# Altium schematic sheet Peripherals.SchDoc: LCL_GDI (DELUX)
size A4; Address1: ludzinc.blogspot.com.au; Address3: www.lowcostlabs.com.au; DocumentNumber: LCL_004; Revision: V2.00; SheetNumber: 6; SheetTotal: 8
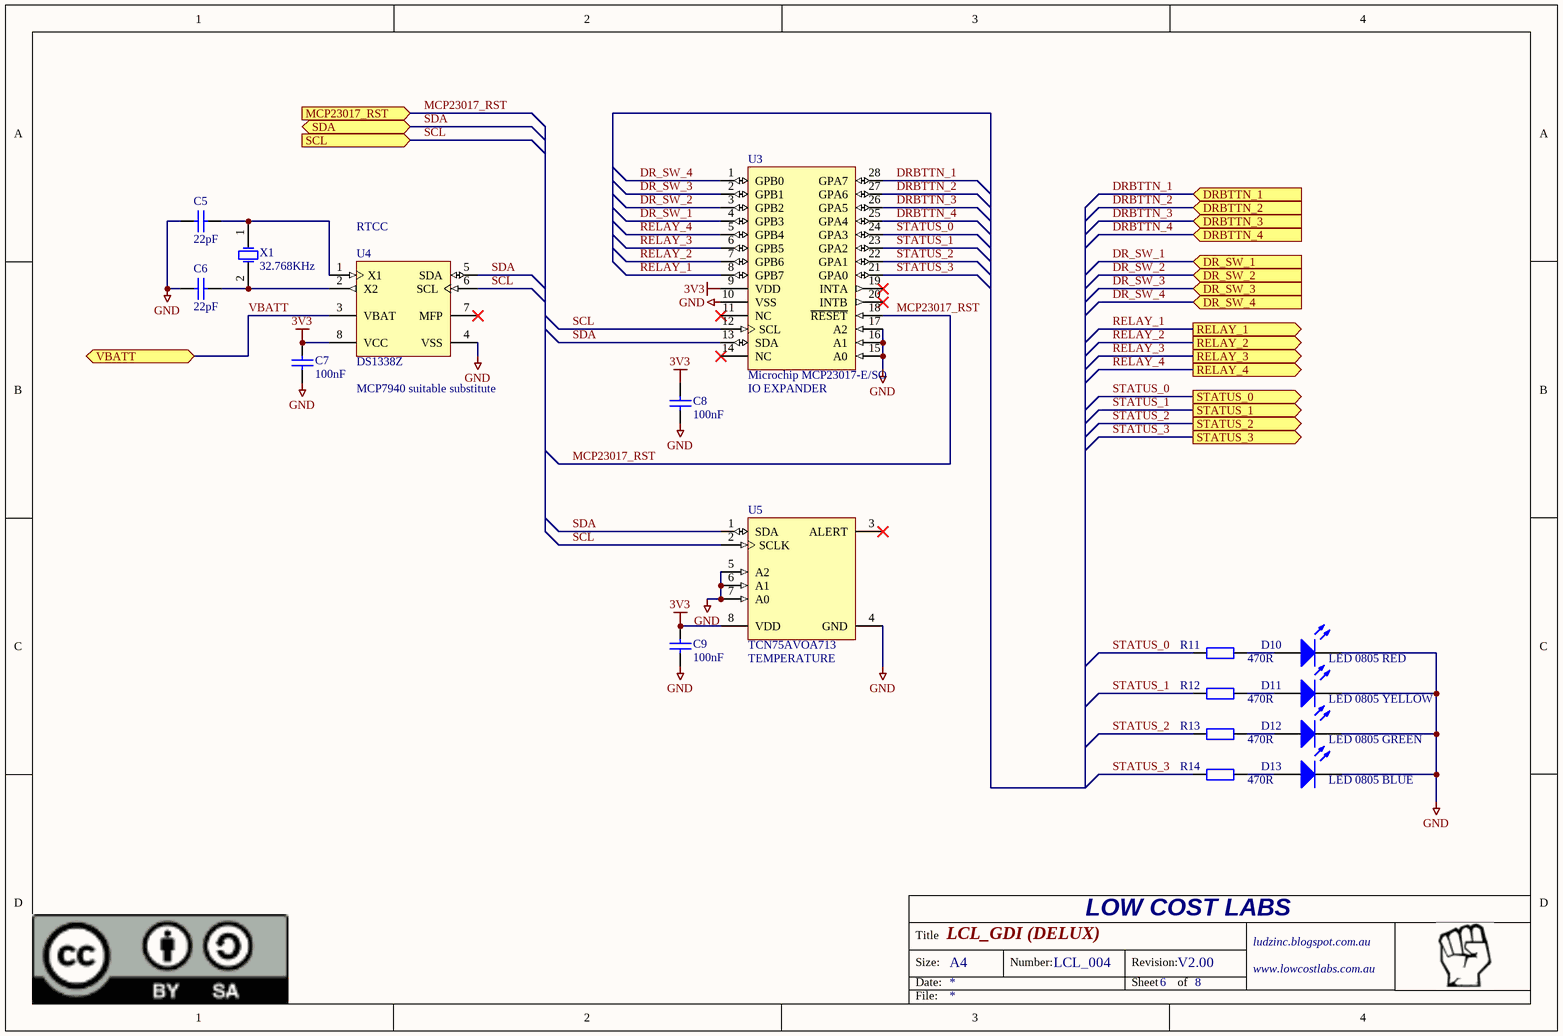
[diagram p0: Peripherals.SchDoc]

## Parts
C5  22pF  [PCB-vlqtv48lgr288fxw4eza-1]
C6  22pF  [PCB-vlqtv48lgr288fxw4eza-1]
C7  100nF  [PCB-vlqtv48lgr288fxw4eza-1]
C8  100nF  [PCB-vlqtv48lgr288fxw4eza-1]
C9  100nF  [PCB-vlqtv48lgr288fxw4eza-1]
D10  LED 0805 RED  [PCB-1071566-1]
D11  LED 0805 YELLOW  [PCB-jd3vqu3yujcdtm6p0xhq-1]
D12  LED 0805 GREEN  [PCB-1071566-1]
D13  LED 0805 BLUE  [PCB-kse1vp9j500ix6ujga0m-1]
R11  470R  [PCB-3652081-2]
R12  470R  [PCB-3652081-2]
R13  470R  [PCB-3652081-2]
R14  470R  [PCB-3652081-2]
U3  Microchip MCP23017-E/SO  [SOIC-SO28_N]
U4  DS1338Z  [SOIC-SN8_N]
U5  TCN75AVOA713  [SOIC-OA8_N]
X1  32.768KHz  [ABRA-AB15T-2_V]

## Ports
DR_SW_1 (in), DR_SW_2 (in), DR_SW_3 (in), DR_SW_4 (in), DRBTTN_1 (in), DRBTTN_2 (in), DRBTTN_3 (in), DRBTTN_4 (in), MCP23017_RST (in), RELAY_1 (out), RELAY_2 (out), RELAY_3 (out), RELAY_4 (out), SCL (in), SDA (bidir), STATUS_0 (out), STATUS_1 (out), STATUS_2 (out), STATUS_3 (out), VBATT

## Nets
3V3: C7.2 C8.2 C9.2 U3.9(VDD) U4.8(VCC) U5.8(VDD)
GND: C5.1 C6.1 C7.1 C8.1 C9.1 D10.K D11.K D12.K D13.K U3.10(VSS) U3.15(A0) U3.16(A1) U3.17(A2) U4.4(VSS) U5.4(GND) U5.5(A2) U5.6(A1) U5.7(A0)
DR_SW_1: U3.4(GPB3) ; port DR_SW_1
DR_SW_2: U3.3(GPB2) ; port DR_SW_2
DR_SW_3: U3.2(GPB1) ; port DR_SW_3
DR_SW_4: U3.1(GPB0) ; port DR_SW_4
DRBTTN_1: U3.28(GPA7) ; port DRBTTN_1
DRBTTN_2: U3.27(GPA6) ; port DRBTTN_2
DRBTTN_3: U3.26(GPA5) ; port DRBTTN_3
DRBTTN_4: U3.25(GPA4) ; port DRBTTN_4
MCP23017_RST: U3.18(~{RESET}) ; port MCP23017_RST
RELAY_1: U3.8(GPB7) ; port RELAY_1
RELAY_2: U3.7(GPB6) ; port RELAY_2
RELAY_3: U3.6(GPB5) ; port RELAY_3
RELAY_4: U3.5(GPB4) ; port RELAY_4
SCL: U3.12(SCL) U4.6(SCL) U5.2(SCLK) ; port SCL
SDA: U3.13(SDA) U4.5(SDA) U5.1(SDA) ; port SDA
STATUS_0: R11.1 U3.24(GPA3) ; port STATUS_0
STATUS_1: R12.1 U3.23(GPA2) ; port STATUS_1
STATUS_2: R13.1 U3.22(GPA1) ; port STATUS_2
STATUS_3: R14.1 U3.21(GPA0) ; port STATUS_3
VBATT: U4.3(VBAT) ; port VBATT
NetC5_2: C5.2 U4.1(X1) X1.1(X1)
NetC6_2: C6.2 U4.2(X2) X1.2(X2)
NetD10_A: D10.A R11.2
NetD11_A: D11.A R12.2
NetD12_A: D12.A R13.2
NetD13_A: D13.A R14.2

Not connected (* = marked no-connect by the designer): U3 11(NC)* 14(NC)* 19(INTA)* 20(INTB)*; U4 7(MFP)*; U5 3(ALERT)*

## Notes on the sheet
- (near U4) RTCC
- MCP7940 suitable substitute
- (near U3) IO EXPANDER
- (near U5) TEMPERATURE
- LOW COST LABS
- Title
- Size:
- Date:
- A4
- Number:
- Revision:
- Sheet
- of
- File:

## Library data of the parts
C5-C9 = CMP-hzp74w7y18pxh5z0pr7s-1: GENERIC 0805 CAPACITOR; CustomComponentID: hzp74w7y18pxh5z0pr7s
D10 = CMP-hyfk0d9q8jygmed95nz1-2: CustomComponentID: hyfk0d9q8jygmed95nz1
D11 = CMP-jd3vqu3yujcdtm6p0xhq-2: CustomComponentID: jd3vqu3yujcdtm6p0xhq
D12 = CMP-qw5bzvzxueusztn5titj-1: CustomComponentID: qw5bzvzxueusztn5titj
D13 = CMP-kse1vp9j500ix6ujga0m-3: CustomComponentID: kse1vp9j500ix6ujga0m
R11-R14 = CMP-rprrpiwz7au7w5x5ojb2-2: GENERIC 0805 RESISTOR; CustomComponentID: rprrpiwz7au7w5x5ojb2
U3 = CMP-1159041-5: MCP23017 Series 5.5 V 1.7 MHz SMT 16-Bit I2C I/O Expander - SOIC-28; Supply Voltage (DC): 5.50 V (max); Lead-Free Status: Lead Free; Supply Current: 1.00 mA; Number of Bits: 16; Octopart URL: http://octopart.com/mcp23017-e%2Fso-microchip-470557; Manufacturer Part Number: MCP23017-E/SO; RoHS: Compliant; REACH SVHC Compliance: No SVHC; Mounting Style: Surface Mount; Packaging: Tube; Case/Package: SOIC; Lifecycle Status: Active; Number of Pins: 28; OctopartID: 0ae1c3ec019ad526
U4 = CMP-1020935-2: Low-Cost I2C Real-Time Clock/Calendar with SRAM and Battery Switchover, 8-Pin SOIC, Industrial Temperature; Lead-Free Status: Lead Free; Lifecycle Status: Active; Mounting Style: Surface Mount; Number of Pins: 8; Octopart Url: https://octopart.com/mcp7940n-i%2Fsn-microchip-19668622; OctopartID: 406188477b899fa6; REACH SVHC Compliance: No SVHC; RoHS: Compliant
U5 = TCN75AVOA713-2: 2-Wire Serial Temperature Sensor, 8-Pin SOIC, Extended Temperature, Tape and Reel; Voltage - Supply: 2.7 V ~ 5.5 V; Sensing Temperature: -55°C ~ 125°C; Topology: ADC (Sigma Delta), Register Bank; CiivaID: 1467894; Output Fan: Yes; Sensor Type: Internal; Accuracy: ±3°C(Max); Output Type: I²CT; Output Alarm: No; Function: Temp Monitoring System (Sensor); Ciiva URL: https://ciiva.com/part/TCN75AVOA713-1467894; Mounting Type: Surface Mount; Supplier Device Package: 8-SOIC N; Packaging: Tape & Reel (TR); Operating Temperature: -55°C ~ 125°C; Family: PMIC - Thermal Management; Package / Case: 8-SOIC (0.154", 3.90mm Width); Category: Integrated Circuits (ICs); Standard Package: 3,300
X1 = CMP-781972-4: Low Frequency Cylindrical Watch Crystal, 32.768 kHz, -20 to 70 degC, 2-Pin 5 x 1.4 x 1.5 mm THD, RoHS, Bulk; Equivalent Series Resistance (ESR): 40000.0 Ω; Frequency: 32768.0 Hz; Lead Length: 0.0043 m; Lead-Free Status: Lead Free; Load Capacitance: 1.25e-11 F; Mounting Style: Through Hole; Number of Pins: 2; Octopart Url: https://octopart.com/ab15t-32.768khz-abracon-315480; OctopartID: 9fa556ab6a9b4062; Packaging: Bulk; REACH SVHC Compliance: No SVHC; RoHS: Compliant; Size-Height: 0.01346 m